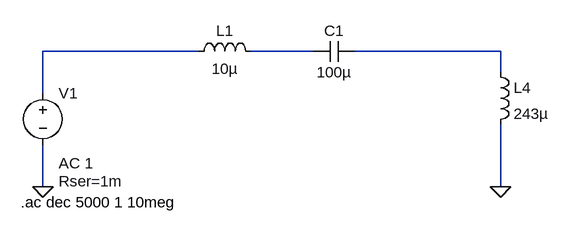
[diagram p0: schematic Draft4.asc]
Draft4.asc, the LTspice schematic file:
Version 4
SHEET 1 948 680
WIRE 240 48 0 48
WIRE 416 48 320 48
WIRE 704 48 480 48
WIRE 704 80 704 48
WIRE 0 112 0 48
WIRE 0 256 0 192
WIRE 704 256 704 160
FLAG 0 256 0
FLAG 704 256 0
SYMBOL voltage 0 96 R0
WINDOW 123 24 124 Left 2
WINDOW 39 24 152 Left 2
SYMATTR InstName V1
SYMATTR Value ""
SYMATTR Value2 AC 1
SYMATTR SpiceLine Rser=1m
SYMBOL ind 224 64 R270
WINDOW 0 32 56 VTop 2
WINDOW 3 5 56 VBottom 2
SYMATTR InstName L1
SYMATTR Value 10µ
SYMBOL cap 480 32 R90
WINDOW 0 0 32 VBottom 2
WINDOW 3 32 32 VTop 2
SYMATTR InstName C1
SYMATTR Value 100µ
SYMBOL ind 688 64 R0
SYMATTR InstName L4
SYMATTR Value 243µ
TEXT -34 280 Left 2 !.ac dec 5000 1 10meg

The netlist it stands for:
* Draft4.asc
V1 N001 0 AC 1 Rser=1m
L1 N001 N002 10µ
C1 N003 N002 100µ
L4 N003 0 243µ
.ac dec 5000 1 10meg
.backanno
.end